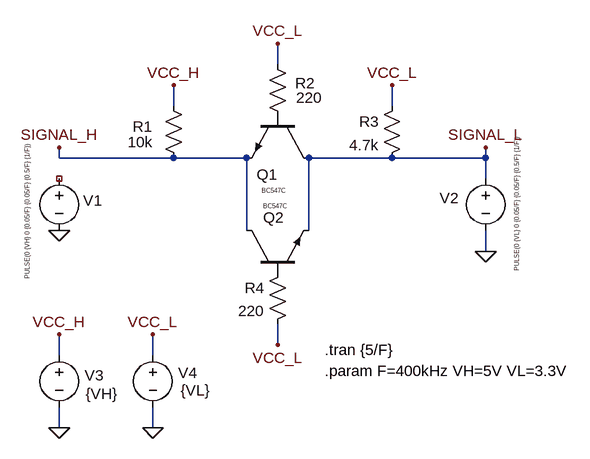
[diagram p0: schematic v1.0.asc]
v1.0.asc, the LTspice schematic file:
Version 4.1
SHEET 1 1008 804
WIRE 464 208 464 176
WIRE 304 272 304 240
WIRE 640 272 640 240
WIRE 128 352 128 336
WIRE 304 352 128 352
WIRE 416 352 304 352
WIRE 640 352 512 352
WIRE 784 352 784 336
WIRE 784 352 640 352
WIRE 784 384 784 352
WIRE 416 464 416 352
WIRE 512 464 512 352
WIRE 784 496 784 464
WIRE 464 640 464 608
WIRE 128 656 128 624
WIRE 272 656 272 624
WIRE 128 768 128 736
WIRE 272 768 272 736
FLAG 128 464 0
FLAG 784 336 SIGNAL_L
FLAG 128 336 SIGNAL_H
FLAG 128 768 0
FLAG 272 768 0
FLAG 128 624 VCC_H
FLAG 272 624 VCC_L
FLAG 464 176 VCC_L
FLAG 640 240 VCC_L
FLAG 304 240 VCC_H
FLAG 464 640 VCC_L
FLAG 784 496 0
SYMBOL res 320 368 R180
WINDOW 0 48 64 Left 2
WINDOW 3 48 40 Left 2
SYMATTR InstName R1
SYMATTR Value 10k
SYMBOL res 480 304 R180
WINDOW 0 -42 67 Left 2
WINDOW 3 -53 45 Left 2
SYMATTR InstName R2
SYMATTR Value 220
SYMBOL voltage 128 368 R0
WINDOW 0 37 50 Left 2
WINDOW 3 -49 -40 VRight 0
WINDOW 123 0 0 Left 0
WINDOW 39 0 0 Left 0
SYMATTR InstName V1
SYMATTR Value PULSE(0 {VH} 0 {0.05/F} {0.05/F} {0.5/F} {1/F})
SYMBOL npn 512 288 R90
WINDOW 0 90 48 VRight 2
WINDOW 3 114 35 VRight 0
SYMATTR InstName Q1
SYMATTR Value BC547C
SYMBOL res 656 256 M0
SYMATTR InstName R3
SYMATTR Value 4.7k
SYMBOL npn 416 528 R270
WINDOW 0 84 26 VRight 2
WINDOW 3 102 26 VRight 0
SYMATTR InstName Q2
SYMATTR Value BC547C
SYMBOL res 480 512 M0
SYMATTR InstName R4
SYMATTR Value 220
SYMBOL voltage 128 640 R0
WINDOW 0 39 47 Left 2
WINDOW 3 41 75 Left 2
WINDOW 123 0 0 Left 0
WINDOW 39 0 0 Left 0
SYMATTR InstName V3
SYMATTR Value {VH}
SYMBOL voltage 272 640 R0
WINDOW 0 39 43 Left 2
WINDOW 3 43 70 Left 2
WINDOW 123 0 0 Left 0
WINDOW 39 0 0 Left 0
SYMATTR InstName V4
SYMATTR Value {VL}
SYMBOL voltage 784 368 R0
WINDOW 0 -71 46 Left 2
WINDOW 3 48 -51 VRight 0
WINDOW 123 0 0 Left 0
WINDOW 39 0 0 Left 0
SYMATTR InstName V2
SYMATTR Value PULSE(0 {VL} 0 {0.05/F} {0.05/F} {0.5/F} {1/F})
TEXT 536 648 Left 2 !.tran {5/F}
TEXT 536 680 Left 2 !.param F=400kHz VH=5V VL=3.3V

The netlist it stands for:
* v1.0.asc
R1 SIGNAL_H VCC_H 10k
R2 P001 VCC_L 220
V1 NC_01 0 PULSE(0 {VH} 0 {0.05/F} {0.05/F} {0.5/F} {1/F})
Q1 SIGNAL_L P001 SIGNAL_H 0 BC547C
R3 VCC_L SIGNAL_L 4.7k
Q2 SIGNAL_H P002 SIGNAL_L 0 BC547C
R4 P002 VCC_L 220
V3 VCC_H 0 {VH}
V4 VCC_L 0 {VL}
V2 SIGNAL_L 0 PULSE(0 {VL} 0 {0.05/F} {0.05/F} {0.5/F} {1/F})
.model NPN NPN
.model PNP PNP
.lib standard.bjt
.tran {5/F}
.param F=400kHz VH=5V VL=3.3V
.backanno
.end

* Results of the author's LTspice run, read from the files saved beside the schematic
* Operating Point, zero values left out:
*   V(p001) = 769.3 mV
*   V(p002) = 767.2 mV
*   V(signal_h) = 10.01 mV
*   V(vcc_h) = 5 V
*   V(vcc_l) = 3.3 V
*   I(R1) = -499 µA
*   I(R2) = -11.5 mA
*   I(R3) = 702.1 µA
*   I(R4) = -11.51 mA
*   I(V2) = 24.22 mA
*   I(V3) = -499 µA
*   I(V4) = -23.72 mA
*   Ib(Q1) = 11.5 mA
*   Ib(Q2) = 11.51 mA
*   Ic(Q1) = -6.67 mA
*   Ic(Q2) = 5.332 mA
*   Ie(Q1) = -4.833 mA
*   Ie(Q2) = -16.84 mA
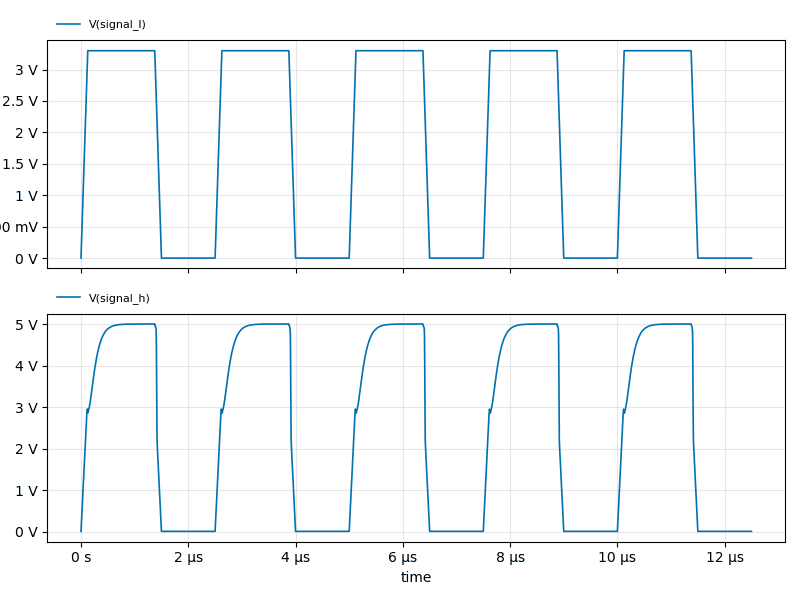
[diagram p1: Transient Analysis of v1.0.asc, plotted from the saved traces]
* Transient Analysis, 1 run:
*   V(signal_l): min 0 V, max 3.3 V, average 1.815 V, rms 2.41 V, last 0 V
*   V(signal_h): min 9.929 mV, max 5 V, average 2.559 V, rms 3.447 V, last 10.02 mV